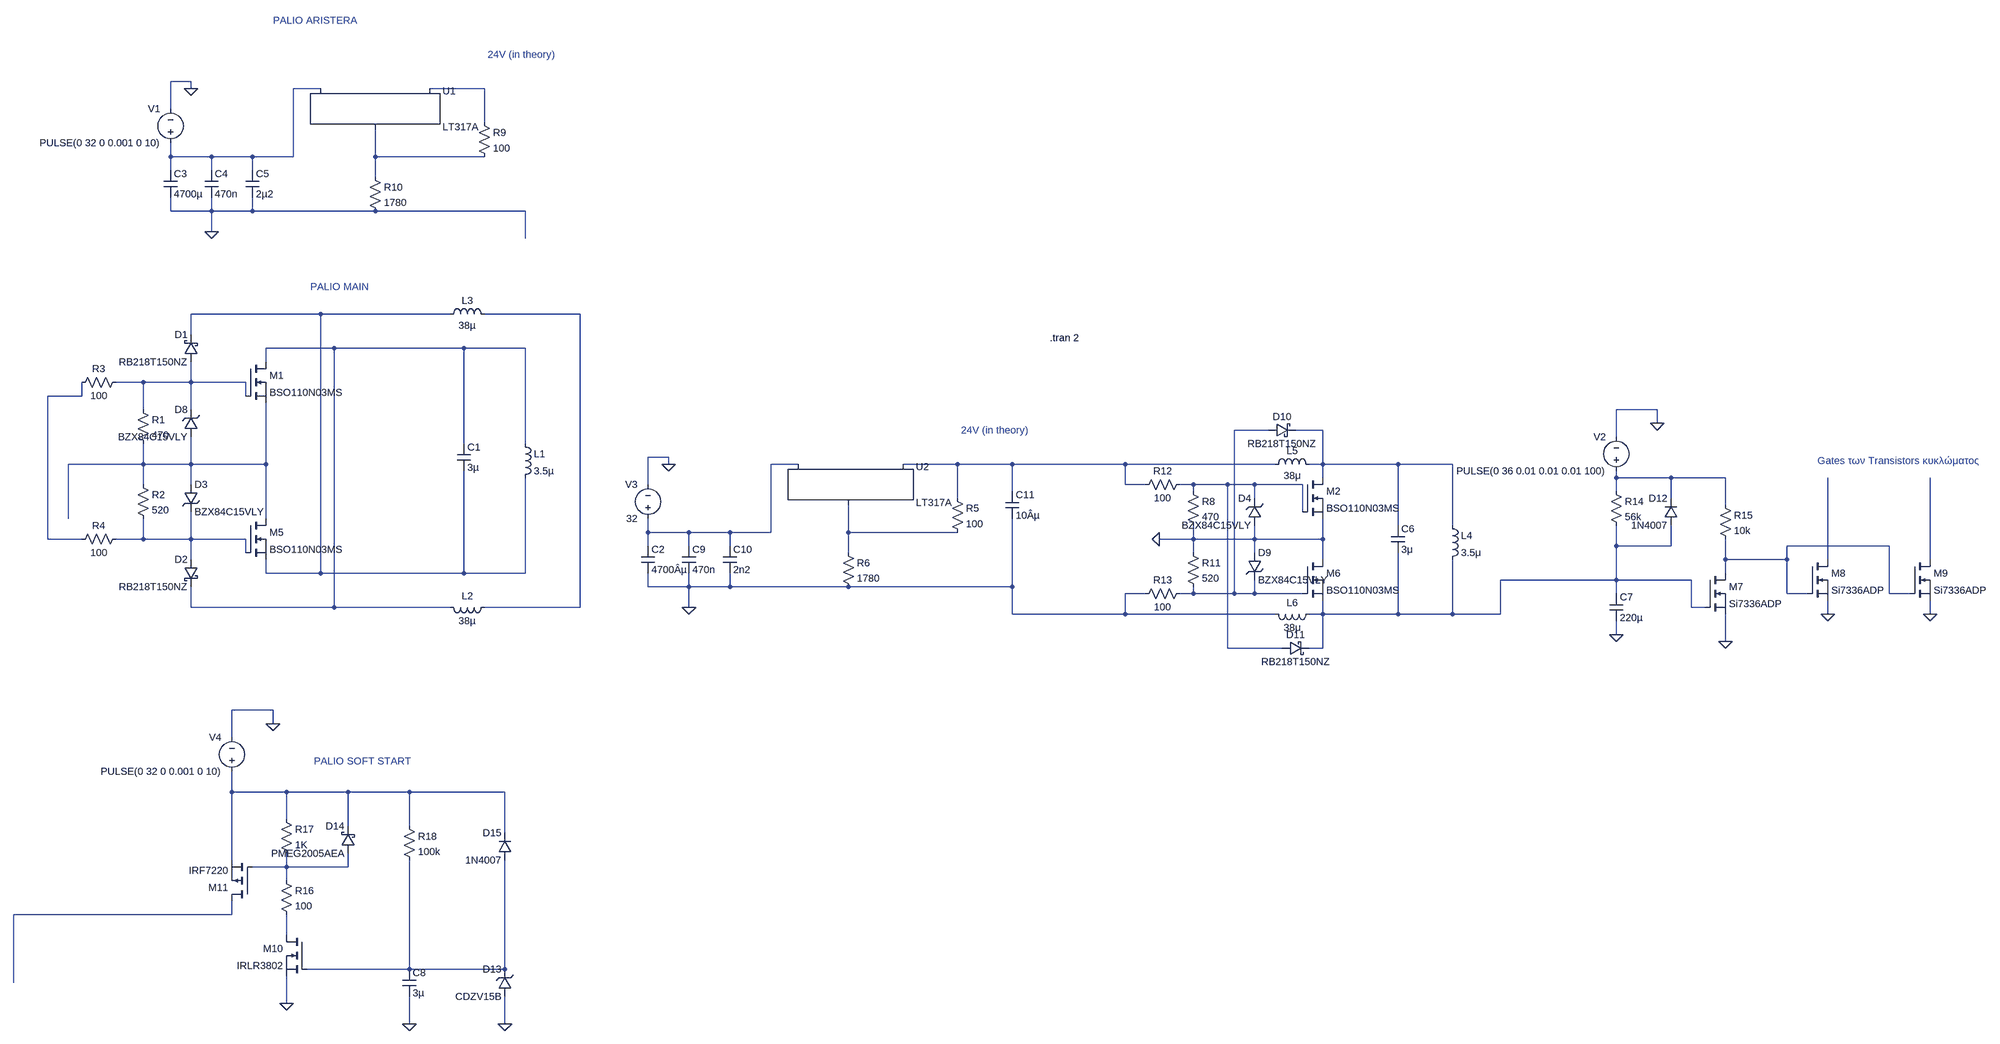
[diagram p0: schematic new_combined.asc]
new_combined.asc, the LTspice schematic file:
Version 4.1
SHEET 1 2732 1648
WIRE -3184 -944 -3232 -944
WIRE -3184 -928 -3184 -944
WIRE -2880 -928 -2944 -928
WIRE -2496 -928 -2624 -928
WIRE -3232 -880 -3232 -944
WIRE -2496 -848 -2496 -928
WIRE -3232 -768 -3232 -800
WIRE -3136 -768 -3232 -768
WIRE -3040 -768 -3136 -768
WIRE -2944 -768 -2944 -928
WIRE -2944 -768 -3040 -768
WIRE -2752 -768 -2752 -832
WIRE -2496 -768 -2752 -768
WIRE -3232 -736 -3232 -768
WIRE -3136 -736 -3136 -768
WIRE -3040 -736 -3040 -768
WIRE -2752 -720 -2752 -768
WIRE -3232 -640 -3232 -672
WIRE -3136 -640 -3136 -672
WIRE -3136 -640 -3232 -640
WIRE -3040 -640 -3040 -672
WIRE -3040 -640 -3136 -640
WIRE -2752 -640 -3040 -640
WIRE -2400 -640 -2752 -640
WIRE -3136 -592 -3136 -640
WIRE -2400 -576 -2400 -640
WIRE -2880 -320 -3184 -320
WIRE -2576 -320 -2880 -320
WIRE -2272 -320 -2496 -320
WIRE -3184 -272 -3184 -320
WIRE -2848 -240 -3008 -240
WIRE -2544 -240 -2848 -240
WIRE -2400 -240 -2544 -240
WIRE -3008 -208 -3008 -240
WIRE -3296 -160 -3360 -160
WIRE -3184 -160 -3184 -208
WIRE -3184 -160 -3296 -160
WIRE -3056 -160 -3184 -160
WIRE -3440 -128 -3440 -160
WIRE -3440 -128 -3520 -128
WIRE -3056 -128 -3056 -160
WIRE -3296 -96 -3296 -160
WIRE -3184 -96 -3184 -160
WIRE 656 -96 560 -96
WIRE 656 -64 656 -96
WIRE -256 -48 -336 -48
WIRE -128 -48 -192 -48
WIRE 560 -32 560 -96
WIRE -2544 -16 -2544 -240
WIRE -2400 -16 -2400 -240
WIRE -1696 16 -1744 16
WIRE -3296 32 -3296 -16
WIRE -3296 32 -3472 32
WIRE -3184 32 -3184 -32
WIRE -3184 32 -3296 32
WIRE -3008 32 -3008 -112
WIRE -3008 32 -3184 32
WIRE -1696 32 -1696 16
WIRE -1392 32 -1456 32
WIRE -1008 32 -1136 32
WIRE -880 32 -1008 32
WIRE -592 32 -880 32
WIRE -240 32 -592 32
WIRE -128 32 -128 -48
WIRE -128 32 -160 32
WIRE 48 32 -128 32
WIRE 176 32 48 32
WIRE -128 64 -128 32
WIRE 560 64 560 48
WIRE 688 64 560 64
WIRE 816 64 688 64
WIRE -3296 80 -3296 32
WIRE -3184 80 -3184 32
WIRE -1744 80 -1744 16
WIRE -592 80 -592 32
WIRE -544 80 -592 80
WIRE -432 80 -464 80
WIRE -352 80 -432 80
WIRE -288 80 -352 80
WIRE -176 80 -288 80
WIRE -880 96 -880 32
WIRE -432 96 -432 80
WIRE 560 96 560 64
WIRE -1008 112 -1008 32
WIRE -288 112 -288 80
WIRE 688 112 688 64
WIRE 816 128 816 64
WIRE -176 144 -176 80
WIRE -3472 160 -3472 32
WIRE -3008 160 -3008 32
WIRE 48 176 48 32
WIRE 176 176 176 32
WIRE -1744 192 -1744 160
WIRE -1648 192 -1744 192
WIRE -1552 192 -1648 192
WIRE -1456 192 -1456 32
WIRE -1456 192 -1552 192
WIRE -1264 192 -1264 128
WIRE -1008 192 -1264 192
WIRE -3520 208 -3520 -128
WIRE -3440 208 -3520 208
WIRE -3296 208 -3296 160
WIRE -3296 208 -3360 208
WIRE -3184 208 -3184 144
WIRE -3184 208 -3296 208
WIRE -3056 208 -3184 208
WIRE -432 208 -432 176
WIRE -432 208 -512 208
WIRE -288 208 -288 176
WIRE -288 208 -432 208
WIRE -128 208 -128 160
WIRE -128 208 -288 208
WIRE -1744 224 -1744 192
WIRE -1648 224 -1648 192
WIRE -1552 224 -1552 192
WIRE 560 224 560 176
WIRE 688 224 688 176
WIRE 688 224 560 224
WIRE 1200 224 960 224
WIRE -3056 240 -3056 208
WIRE -1264 240 -1264 192
WIRE -432 240 -432 208
WIRE -288 240 -288 208
WIRE -3184 256 -3184 208
WIRE -128 256 -128 208
WIRE 816 256 816 208
WIRE 960 256 960 224
WIRE 960 256 816 256
WIRE 1056 256 1056 64
WIRE 1296 256 1296 64
WIRE -3008 288 -3008 256
WIRE -2880 288 -2880 -320
WIRE -2880 288 -3008 288
WIRE -2544 288 -2544 48
WIRE -2544 288 -2880 288
WIRE -2400 288 -2400 64
WIRE -2400 288 -2544 288
WIRE 816 288 816 256
WIRE 560 304 560 224
WIRE 560 304 288 304
WIRE 736 304 560 304
WIRE -1744 320 -1744 288
WIRE -1648 320 -1648 288
WIRE -1648 320 -1744 320
WIRE -1552 320 -1552 288
WIRE -1552 320 -1648 320
WIRE -1264 320 -1552 320
WIRE -880 320 -880 160
WIRE -880 320 -1264 320
WIRE -544 336 -592 336
WIRE -432 336 -432 320
WIRE -432 336 -464 336
WIRE -336 336 -336 -48
WIRE -336 336 -432 336
WIRE -288 336 -288 304
WIRE -288 336 -336 336
WIRE -176 336 -288 336
WIRE 560 336 560 304
WIRE 960 336 960 256
WIRE 1008 336 960 336
WIRE 1200 336 1200 224
WIRE 1248 336 1200 336
WIRE -3184 368 -3184 320
WIRE -2848 368 -2848 -240
WIRE -2848 368 -3184 368
WIRE -2576 368 -2848 368
WIRE -2272 368 -2272 -320
WIRE -2272 368 -2496 368
WIRE -1648 368 -1648 320
WIRE 736 368 736 304
WIRE 768 368 736 368
WIRE -880 384 -880 320
WIRE -592 384 -592 336
WIRE -592 384 -880 384
WIRE -240 384 -592 384
WIRE -128 384 -128 352
WIRE -128 384 -160 384
WIRE 48 384 48 240
WIRE 48 384 -128 384
WIRE 176 384 176 256
WIRE 176 384 48 384
WIRE 288 384 288 304
WIRE 288 384 176 384
WIRE 1056 384 1056 352
WIRE 1296 384 1296 352
WIRE 560 432 560 400
WIRE 816 448 816 384
WIRE -352 464 -352 80
WIRE -224 464 -352 464
WIRE -128 464 -128 384
WIRE -128 464 -160 464
WIRE -2992 656 -3088 656
WIRE -2992 688 -2992 656
WIRE -3088 720 -3088 656
WIRE -3088 848 -3088 800
WIRE -2960 848 -3088 848
WIRE -2816 848 -2960 848
WIRE -2672 848 -2816 848
WIRE -2448 848 -2672 848
WIRE -2960 912 -2960 848
WIRE -2816 928 -2816 848
WIRE -2672 928 -2672 848
WIRE -2448 944 -2448 848
WIRE -3088 1008 -3088 848
WIRE -2960 1024 -2960 992
WIRE -2960 1024 -3040 1024
WIRE -2816 1024 -2816 992
WIRE -2816 1024 -2960 1024
WIRE -2960 1056 -2960 1024
WIRE -3088 1136 -3088 1104
WIRE -3088 1136 -3600 1136
WIRE -2960 1184 -2960 1136
WIRE -2672 1264 -2672 1008
WIRE -2672 1264 -2912 1264
WIRE -2448 1264 -2448 1008
WIRE -2448 1264 -2672 1264
WIRE -3600 1296 -3600 1136
WIRE -2960 1344 -2960 1280
WIRE -2672 1392 -2672 1328
WIRE -2448 1392 -2448 1328
FLAG -3184 -928 0
FLAG -3136 -592 0
FLAG -512 208 0
FLAG 656 -64 0
FLAG 560 432 0
FLAG 816 448 0
FLAG 1296 384 0
FLAG 1056 384 0
FLAG -2960 1344 0
FLAG -2672 1392 0
FLAG -2448 1392 0
FLAG -2992 688 0
FLAG -1696 32 0
FLAG -1648 368 0
SYMBOL cap -2560 -16 R0
SYMATTR InstName C1
SYMATTR Value 3µ
SYMBOL ind -2416 -32 R0
SYMATTR InstName L1
SYMATTR Value 3.5µ
SYMBOL ind -2480 352 R90
WINDOW 0 5 56 VBottom 2
WINDOW 3 32 56 VTop 2
SYMATTR InstName L2
SYMATTR Value 38µ
SYMBOL ind -2592 -304 R270
WINDOW 0 32 56 VTop 2
WINDOW 3 5 56 VBottom 2
SYMATTR InstName L3
SYMATTR Value 38µ
SYMBOL nmos -3056 -208 R0
SYMATTR InstName M1
SYMATTR Value BSO110N03MS
SYMBOL schottky -3168 -208 R180
WINDOW 0 24 64 Left 2
WINDOW 3 24 0 Left 2
SYMATTR InstName D1
SYMATTR Value RB218T150NZ
SYMATTR Description Diode
SYMATTR Type diode
SYMBOL res -3312 -112 R0
SYMATTR InstName R1
SYMATTR Value 470
SYMBOL res -3312 64 R0
SYMATTR InstName R2
SYMATTR Value 520
SYMBOL res -3344 -176 R90
WINDOW 0 0 56 VBottom 2
WINDOW 3 32 56 VTop 2
SYMATTR InstName R3
SYMATTR Value 100
SYMBOL res -3344 192 R90
WINDOW 0 0 56 VBottom 2
WINDOW 3 32 56 VTop 2
SYMATTR InstName R4
SYMATTR Value 100
SYMBOL cap -3248 -736 R0
SYMATTR InstName C3
SYMATTR Value 4700µ
SYMBOL cap -3152 -736 R0
SYMATTR InstName C4
SYMATTR Value 470n
SYMBOL cap -3056 -736 R0
SYMATTR InstName C5
SYMATTR Value 2µ2
SYMBOL res -2512 -864 R0
SYMATTR InstName R9
SYMATTR Value 100
SYMBOL PowerProducts\\LT317A -2752 -928 R0
SYMATTR InstName U1
SYMBOL res -2768 -736 R0
SYMATTR InstName R10
SYMATTR Value 1780
SYMBOL nmos -3056 160 R0
SYMATTR InstName M5
SYMATTR Value BSO110N03MS
SYMBOL voltage -3232 -784 R180
WINDOW 0 24 96 Left 2
WINDOW 3 24 16 Left 2
WINDOW 123 0 0 Left 0
WINDOW 39 0 0 Left 0
SYMATTR InstName V1
SYMATTR Value PULSE(0 32 0 0.001 0 10)
SYMBOL schottky -3168 256 M0
SYMATTR InstName D2
SYMATTR Value RB218T150NZ
SYMATTR Description Diode
SYMATTR Type diode
SYMBOL zener -3168 -32 R180
WINDOW 0 24 64 Left 2
WINDOW 3 24 0 Left 2
SYMATTR InstName D8
SYMATTR Value BZX84C15VLY
SYMATTR Description Diode
SYMATTR Type diode
SYMBOL zener -3200 80 R0
SYMATTR InstName D3
SYMATTR Value BZX84C15VLY
SYMATTR Description Diode
SYMATTR Type diode
SYMBOL cap 32 176 R0
SYMATTR InstName C6
SYMATTR Value 3μ
SYMBOL ind 160 160 R0
SYMATTR InstName L4
SYMATTR Value 3.5μ
SYMATTR SpiceLine Rser=1m
SYMBOL nmos -176 64 R0
SYMATTR InstName M2
SYMATTR Value BSO110N03MS
SYMBOL nmos -176 256 R0
SYMATTR InstName M6
SYMATTR Value BSO110N03MS
SYMBOL zener -272 176 R180
WINDOW 0 24 64 Left 2
WINDOW 3 24 0 Left 2
SYMATTR InstName D4
SYMATTR Value BZX84C15VLY
SYMATTR Description Diode
SYMATTR Type diode
SYMBOL zener -304 240 R0
SYMATTR InstName D9
SYMATTR Value BZX84C15VLY
SYMATTR Description Diode
SYMATTR Type diode
SYMBOL ind -256 48 R270
WINDOW 0 32 56 VTop 2
WINDOW 3 5 56 VBottom 2
SYMATTR InstName L5
SYMATTR Value 38μ
SYMATTR SpiceLine Rser=1m
SYMBOL ind -144 368 R90
WINDOW 0 5 56 VBottom 2
WINDOW 3 32 56 VTop 2
SYMATTR InstName L6
SYMATTR Value 38μ
SYMATTR SpiceLine Rser=1m
SYMBOL res -448 80 R0
SYMATTR InstName R8
SYMATTR Value 470
SYMBOL res -448 224 R0
SYMATTR InstName R11
SYMATTR Value 520
SYMBOL res -448 64 R90
WINDOW 0 0 56 VBottom 2
WINDOW 3 32 56 VTop 2
SYMATTR InstName R12
SYMATTR Value 100
SYMBOL res -448 320 R90
WINDOW 0 0 56 VBottom 2
WINDOW 3 32 56 VTop 2
SYMATTR InstName R13
SYMATTR Value 100
SYMBOL schottky -256 -32 R270
WINDOW 0 32 32 VTop 2
WINDOW 3 0 32 VBottom 2
SYMATTR InstName D10
SYMATTR Value RB218T150NZ
SYMATTR Description Diode
SYMATTR Type diode
SYMBOL schottky -224 448 M90
WINDOW 0 0 32 VBottom 2
WINDOW 3 32 32 VTop 2
SYMATTR InstName D11
SYMATTR Value RB218T150NZ
SYMATTR Description Diode
SYMATTR Type diode
SYMBOL voltage 560 64 R180
WINDOW 0 24 96 Left 2
WINDOW 3 24 16 Left 2
WINDOW 123 0 0 Left 0
WINDOW 39 0 0 Left 0
SYMATTR InstName V2
SYMATTR Value PULSE(0 36 0.01 0.01 0.01 100)
SYMBOL res 544 80 R0
SYMATTR InstName R14
SYMATTR Value 56k
SYMBOL diode 704 176 R180
WINDOW 0 24 64 Left 2
WINDOW 3 24 0 Left 2
SYMATTR InstName D12
SYMATTR Value 1N4007
SYMBOL res 800 112 R0
SYMATTR InstName R15
SYMATTR Value 10k
SYMBOL cap 544 336 R0
SYMATTR InstName C7
SYMATTR Value 220µ
SYMBOL nmos 768 288 R0
SYMATTR InstName M7
SYMATTR Value Si7336ADP
SYMBOL nmos 1008 256 R0
SYMATTR InstName M8
SYMATTR Value Si7336ADP
SYMBOL nmos 1248 256 R0
SYMATTR InstName M9
SYMATTR Value Si7336ADP
SYMBOL cap -2688 1264 R0
SYMATTR InstName C8
SYMATTR Value 3µ
SYMATTR SpiceLine V=50 Irms=10.2 Rser=0.027 Lser=0
SYMBOL zener -2432 1328 R180
WINDOW 0 24 64 Left 2
WINDOW 3 24 0 Left 2
SYMATTR InstName D13
SYMATTR Value CDZV15B
SYMATTR Description Diode
SYMATTR Type diode
SYMBOL nmos -2912 1184 M0
SYMATTR InstName M10
SYMATTR Value IRLR3802
SYMBOL res -2976 1040 R0
SYMATTR InstName R16
SYMATTR Value 100
SYMATTR SpiceLine tol=1 pwr=0.1
SYMBOL res -2976 896 R0
SYMATTR InstName R17
SYMATTR Value 1K
SYMATTR SpiceLine tol=1 pwr=0.1
SYMBOL schottky -2800 992 R180
WINDOW 0 24 64 Left 2
WINDOW 3 24 0 Left 2
SYMATTR InstName D14
SYMATTR Value PMEG2005AEA
SYMATTR Description Diode
SYMATTR Type diode
SYMBOL res -2688 912 R0
SYMATTR InstName R18
SYMATTR Value 100k
SYMATTR SpiceLine tol=1 pwr=0.1
SYMBOL diode -2432 1008 R180
WINDOW 0 24 64 Left 2
WINDOW 3 24 0 Left 2
SYMATTR InstName D15
SYMATTR Value 1N4007
SYMBOL pmos -3040 1104 R180
SYMATTR InstName M11
SYMATTR Value IRF7220
SYMBOL voltage -3088 816 R180
WINDOW 0 24 96 Left 2
WINDOW 3 24 16 Left 2
WINDOW 123 0 0 Left 0
WINDOW 39 0 0 Left 0
SYMATTR InstName V4
SYMATTR Value PULSE(0 32 0 0.001 0 10)
SYMBOL voltage -1744 176 R180
WINDOW 0 24 96 Left 2
WINDOW 3 24 16 Left 2
WINDOW 123 0 0 Left 0
WINDOW 39 0 0 Left 0
SYMATTR InstName V3
SYMATTR Value 32
SYMBOL cap -1760 224 R0
SYMATTR InstName C2
SYMATTR Value 4700Âµ
SYMBOL cap -1664 224 R0
SYMATTR InstName C9
SYMATTR Value 470n
SYMBOL cap -1568 224 R0
SYMATTR InstName C10
SYMATTR Value 2n2
SYMBOL res -1024 96 R0
SYMATTR InstName R5
SYMATTR Value 100
SYMBOL PowerProducts\\LT317A -1264 32 R0
SYMATTR InstName U2
SYMBOL res -1280 224 R0
SYMATTR InstName R6
SYMATTR Value 1780
SYMBOL cap -896 96 R0
SYMATTR InstName C11
SYMATTR Value 10Âµ
TEXT -2488 -1008 Left 2 ;24V (in theory)
TEXT -792 -264 Left 2 !.tran 2
TEXT 1032 24 Left 2 ;Gates των Transistors κυκλώματος
TEXT -2896 776 Left 2 ;PALIO SOFT START
TEXT -2904 -384 Left 2 ;PALIO MAIN
TEXT -2992 -1088 Left 2 ;PALIO ARISTERA
TEXT -1000 -48 Left 2 ;24V (in theory)

The netlist it stands for:
* new_combined.asc
C1 N006 N004 3µ
L1 N006 N004 3.5µ
L2 N005 N006 38µ
L3 N004 N005 38µ
M1 N006 N007 N011 N011 BSO110N03MS
D1 N007 N004 RB218T150NZ
R1 N007 N011 470
R2 N011 N017 520
R3 N007 N008 100
R4 N017 N008 100
C3 N001 0 4700µ
C4 N001 0 470n
C5 N001 0 2µ2
R9 N002 N003 100
X§U1 N003 N002 N001 LT317A
R10 N003 0 1780
M5 N011 N017 N004 N004 BSO110N03MS
V1 N001 0 PULSE(0 32 0 0.001 0 10)
D2 N017 N006 RB218T150NZ
D8 N011 N007 BZX84C15VLY
D3 N011 N017 BZX84C15VLY
C6 N010 N018 3μ
L4 N010 N018 3.5μ Rser=1m
M2 N010 N015 0 0 BSO110N03MS
M6 0 N009 N018 N018 BSO110N03MS
D4 0 N015 BZX84C15VLY
D9 0 N009 BZX84C15VLY
L5 N013 N010 38μ Rser=1m
L6 N018 0 38μ Rser=1m
R8 N015 0 470
R11 0 N009 520
R12 N015 N013 100
R13 N009 0 100
D10 N009 N010 RB218T150NZ
D11 N015 N018 RB218T150NZ
V2 N014 0 PULSE(0 36 0.01 0.01 0.01 100)
R14 N014 N018 56k
D12 N018 N014 1N4007
R15 N014 N019 10k
C7 N018 0 220µ
M7 N019 N018 0 0 Si7336ADP
M8 N020 N019 0 0 Si7336ADP
M9 N021 N019 0 0 Si7336ADP
C8 N026 0 3µ V=50 Irms=10.2 Rser=0.027 Lser=0
D13 0 N026 CDZV15B
M10 N025 N026 0 0 IRLR3802
R16 N023 N025 100 tol=1 pwr=0.1
R17 N022 N023 1K tol=1 pwr=0.1
D14 N023 N022 PMEG2005AEA
R18 N022 N026 100k tol=1 pwr=0.1
D15 N026 N022 1N4007
M11 N024 N023 N022 N022 IRF7220
V4 N022 0 PULSE(0 32 0 0.001 0 10)
V3 N012 0 32
C2 N012 0 4700Âµ
C9 N012 0 470n
C10 N012 0 2n2
R5 N013 N016 100
X§U2 N016 N013 N012 LT317A
R6 N016 0 1780
C11 N013 0 10Âµ
.model D D
.lib standard.dio
.model NMOS NMOS
.model PMOS PMOS
.lib standard.mos
* 24V (in theory)
.tran 2
* Gates των Transistors κυκλώματος
* PALIO SOFT START
* PALIO MAIN
* PALIO ARISTERA
* 24V (in theory)
.lib LTC.lib
.backanno
.end